# EAGLE design mb3 (EAGLE 7.3.2)
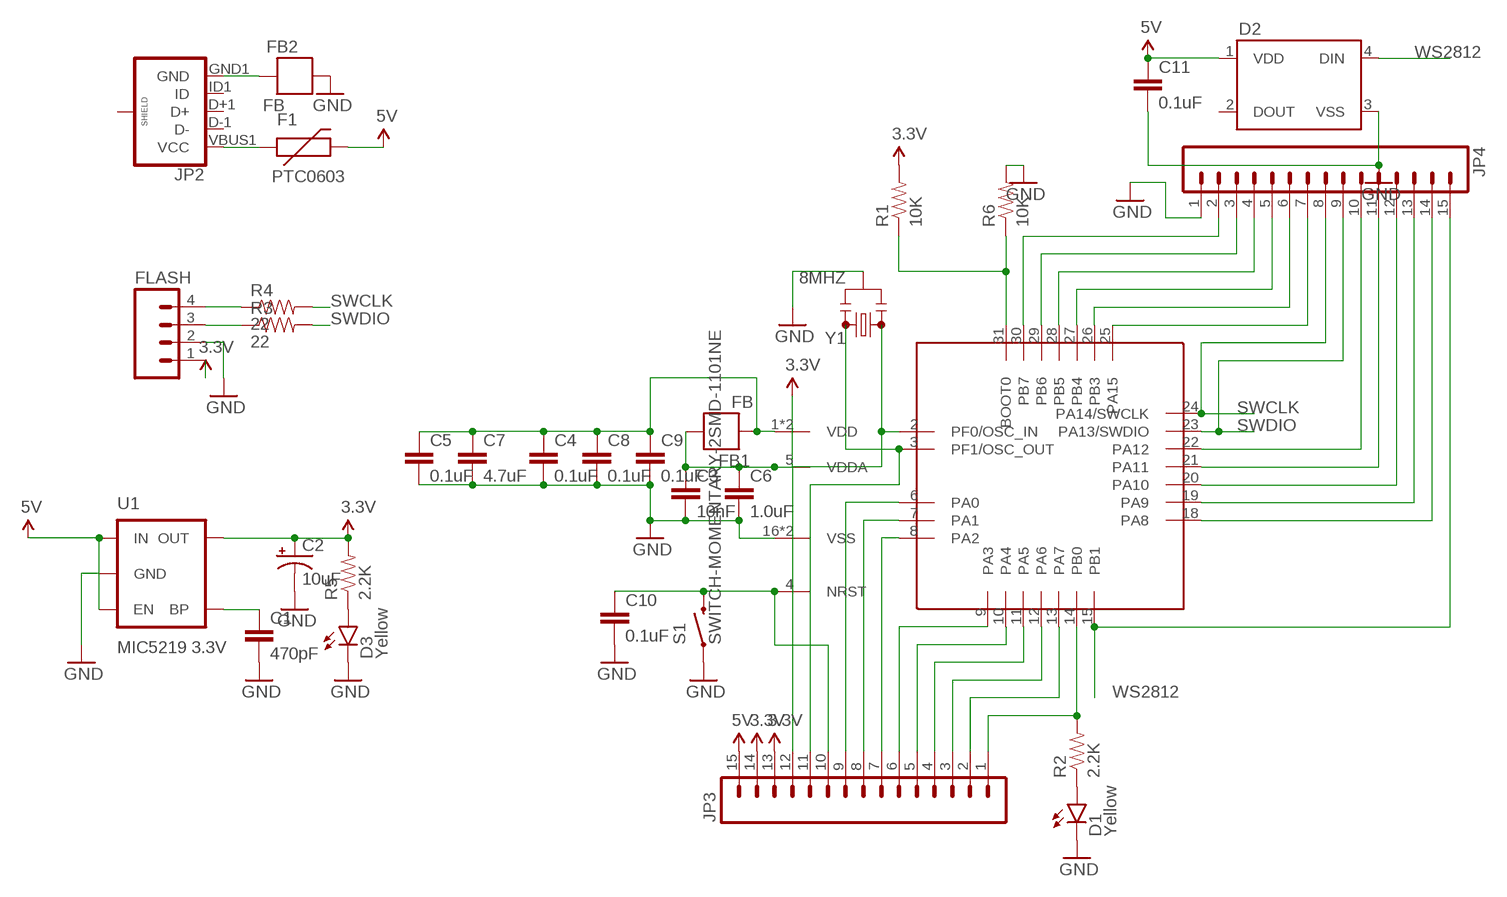
[diagram p0: schematic, sheet 1]

## Parts
C1  470pF  CAP0402-CAP  [0402-CAP]
C2  10uF  10UF-16V-10%(TANT)  [EIA3216]
C3  10nF  CAP0402-CAP  [0402-CAP]
C4  0.1uF  CAP0402-CAP  [0402-CAP]
C5  0.1uF  CAP0402-CAP  [0402-CAP]
C6  1.0uF  1.0UF-16V-10%(0603)  [0603-CAP]
C7  4.7uF  4.7UF-6.3V-10%(0603)0603  [0603-CAP]
C8  0.1uF  CAP0402-CAP  [0402-CAP]
C9  0.1uF  CAP0402-CAP  [0402-CAP]
C10  0.1uF  CAP0402-CAP  [0402-CAP]
C11  0.1uF  CAP0402-CAP  [0402-CAP]
D1  Yellow  LED-YELLOW0603  [LED-0603]
D2  WS2812B  [WS2812B]
D3  Yellow  LED-YELLOW0603  [LED-0603]
F1  PTC0603  [0603]
FB1  FB  [0603]
FB2  FB  [0603]
FLASH  M04SMD  [1X04-SMD]
JP2  USB_MICROB_PLUGCONN-11752  [USB-B-MICRO-SMD_V03]
JP3  M15LOCK  [1X15_LOCK]
JP4  M15LOCK  [1X15_LOCK]
R1  10K  22OHM1/10W1%(0402)  [0402-RES]
R2  2.2K  RESISTOR0402  [0402-RES]
R3  22  22OHM1/10W1%(0402)  [0402-RES]
R4  22  22OHM1/10W1%(0402)  [0402-RES]
R5  2.2K  RESISTOR0402  [0402-RES]
R6  10K  22OHM1/10W1%(0402)  [0402-RES]
S1  SWITCH-MOMENTARY-2SMD-1101NE  [TACTILE-SWITCH-1101NE]
U1  MIC5219 3.3V  V_REG_MIC52193.3V  [SOT23-5]
U2  STM32F030K6P6  [LQFP32-0.8]
Y1  8MHZ  RESONATOR8MHZ  [RESONATOR-SMD]

## Nets
3.3V: C2.A(+) C3.1 C6.1 FB1.1 FLASH.1 JP3.13 JP3.14 R1.2 R5.2 U1.5(OUT) U2.5(VDDA)
5V: C11.1 D2.1(VDD) F1.2 JP3.15 U1.1(IN) U1.3(EN)
A15: JP4.7 U2.25(PA15)
COPOY: C1.2 C2.C(-) C3.2 C4.2 C5.2 C6.2 C7.2 C8.2 C9.2 C10.2 C11.2 D1.C D2.3(VSS) D3.C FB2.1 FLASH.2 JP4.1 R6.2 S1.1 U1.2(GND) U2.16(VSS) U2.32(VSS) Y1.2 ; supply symbol labelled GND
N$1: C4.1 C5.1 C7.1 C8.1 C9.1 FB1.2 U2.1(VDD) U2.17(VDD)
N$3: C1.1 U1.4(BP)
N$4: FLASH.3 R3.1
N$5: FLASH.4 R4.1
N$7: D1.A R2.1
N$9: R1.1 R6.1 U2.31(BOOT0)
N$11: FB2.2 JP2.GND1(GND)
N$12: F1.1 JP2.VBUS1(VCC)
N$13: JP4.2 U2.30(PB7)
N$14: JP4.3 U2.29(PB6)
N$15: JP4.4 U2.28(PB5)
N$16: JP4.5 U2.27(PB4)
N$17: JP4.6 U2.26(PB3)
N$19: JP4.10 U2.22(PA12)
N$20: JP4.11 U2.21(PA11)
N$21: JP4.12 U2.20(PA10)
N$22: JP4.13 U2.19(PA9)
N$23: JP4.14 U2.18(PA8)
N$24: JP3.2 U2.13(PA7)
N$25: JP3.3 U2.12(PA6)
N$26: JP3.4 U2.11(PA5)
N$27: JP3.5 U2.10(PA4)
N$28: JP3.6 U2.9(PA3)
N$29: JP3.7 U2.8(PA2)
N$30: JP3.8 U2.7(PA1)
N$31: JP3.9 U2.6(PA0)
N$32: D3.A R5.1
NRST: C10.1 JP3.10 S1.2 U2.4(NRST)
PB0: JP3.1 R2.2 U2.14(PB0)
PF0: JP3.12 U2.2(PF0/OSC_IN) Y1.1
PF1: JP3.11 U2.3(PF1/OSC_OUT) Y1.3
SWCLK: JP4.8 R4.2 U2.24(PA14/SWCLK)
SWDIO: JP4.9 R3.2 U2.23(PA13/SWDIO)
WS2812: D2.4(DIN) JP4.15 U2.15(PB1)
Unconnected: D2.2(DOUT) JP2.D+1(D+) JP2.D-1(D-) JP2.ID1(ID) JP2.SHIELD1(SHIELD) JP2.SHIELD2(SHIELD) JP2.SHIELD3(SHIELD)

## Library data of the parts
C1 C3-C5 C8-C11 = SparkFun-Capacitors:CAP: Capacitor Standard 0603 ceramic capacitor, and 0.1" leaded capacitor.
C2 = SparkFun-Capacitors:10UF-16V-10%(TANT): CAP-00811 1206/EIA-3216 Tantalum capacitor; PROD_ID: CAP-00811
C6 = SparkFun-Capacitors:1.0UF-16V-10%(0603): CAP-00868; PROD_ID: CAP-00868
C7 = SparkFun-Capacitors:4.7UF-6.3V-10%(0603): CAP-08280; PROD_ID: CAP-08280
D1 D3 = SparkFun-LED:LED-YELLOW: Yellow SMD LEDs LilyPad 1206- DIO-09909 0603- DIO-09003 "SMART" means more efficient and expensive; PROD_ID: DIO-09003
D2 = SparkFun-LED:WS2812B: WS2812B - Intelligent control LED integrated light source Technical Specifications: Power Supply Voltage (VDD): 3.5 to 5.3 V Input Voltage (VI): -0.5 to VDD+0.5 V Operating Junction Temperature (Topt): -25°C to +80°C Storage Temperature Range (Tstg): -55°C to +150°C; PROD_ID: DIO-12503
F1 = SparkFun-PowerIC:PTC: Resettable Fuse PTC Resettable Fuse. Spark Fun Electronics SKU : COM-08357
FB1 FB2 = SparkFun-Passives:FB
FLASH = SparkFun-Connectors:M04: Header 4 Standard 4-pin 0.1" header. Use with straight break away headers (SKU : PRT-00116), right angle break away headers (PRT-00553), swiss pins (PRT-00743), machine pins (PRT-00117), and female headers (PRT-00115). Molex polarized connector foot print use with SKU : PRT-08231 with associated crimp pins and housings. 1MM SMD Version SKU: PRT-10208
JP2 = SparkFun-Connectors:USB_MICROB_PLUG: USB Micro-B connectors Some male, some female. Watch your step!; PROD_ID: CONN-11752
JP3 JP4 = SparkFun-Connectors:M15: Header 15 Standard 15-pin 0.1" header. Use with straight break away headers (SKU : PRT-00116), right angle break away headers (PRT-00553), swiss pins (PRT-00743), machine pins (PRT-00117), and female headers (PRT-00115).
R1 R6 = SparkFun-Resistors:22OHM1/10W1%(0402); PROD_ID: RES-12427; VALUE: 22
R2 R5 = SparkFun-Resistors:RESISTOR: Resistor Basic schematic elements and footprints for 0603, 1206, and PTH resistors.
R3 R4 = SparkFun-Resistors:22OHM1/10W1%(0402); PROD_ID: RES-12427
S1 = SparkFun-Electromechanical:SWITCH-MOMENTARY-2: Various NO switches- pushbuttons, reed, etc; PROD_ID: SWCH-00815
U1 = SparkFun-PowerIC:V_REG_MIC5219: V_REG MIC5219 Standard 3.3V and 5V 500mA LDO voltage regulator in SOT-23 layout. Micrel part MIC5219. BP (by-pass) pin is used to lower output noise with 470pF cap, may be left open.; PROD_ID: VREG-09872
U2 = r1:STM32F030K6P6
Y1 = SparkFun-FreqCtrl:RESONATOR: Resonator Small SMD resonator. Used, eg, on the Arduino Pro/ Pro Mini boards. 8MHz- XTAL-08895 16MHz- XTAL-08900; PROD_ID: XTAL-08895

## Board
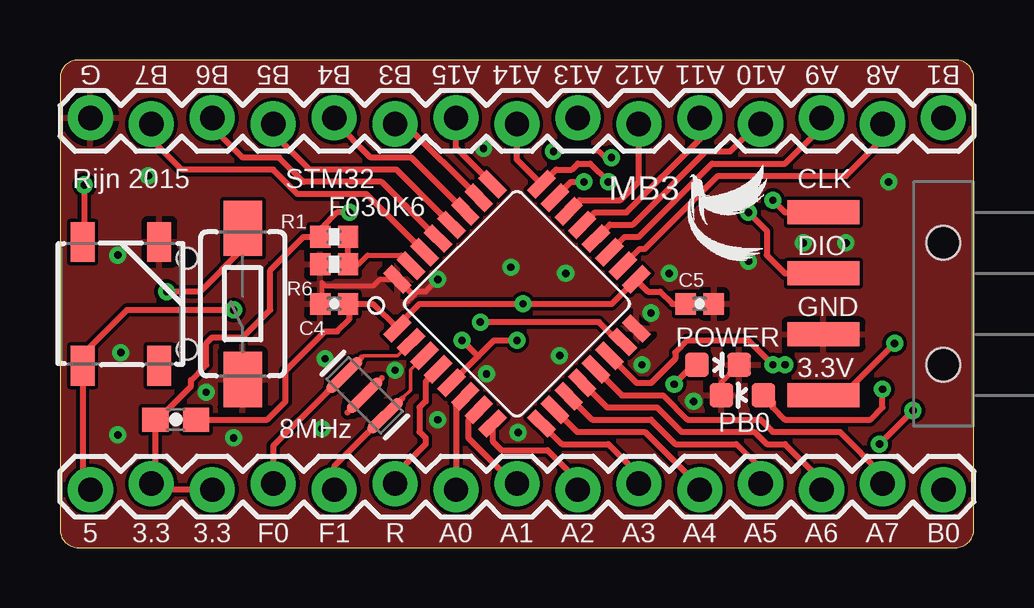
[diagram p1: board, top side]
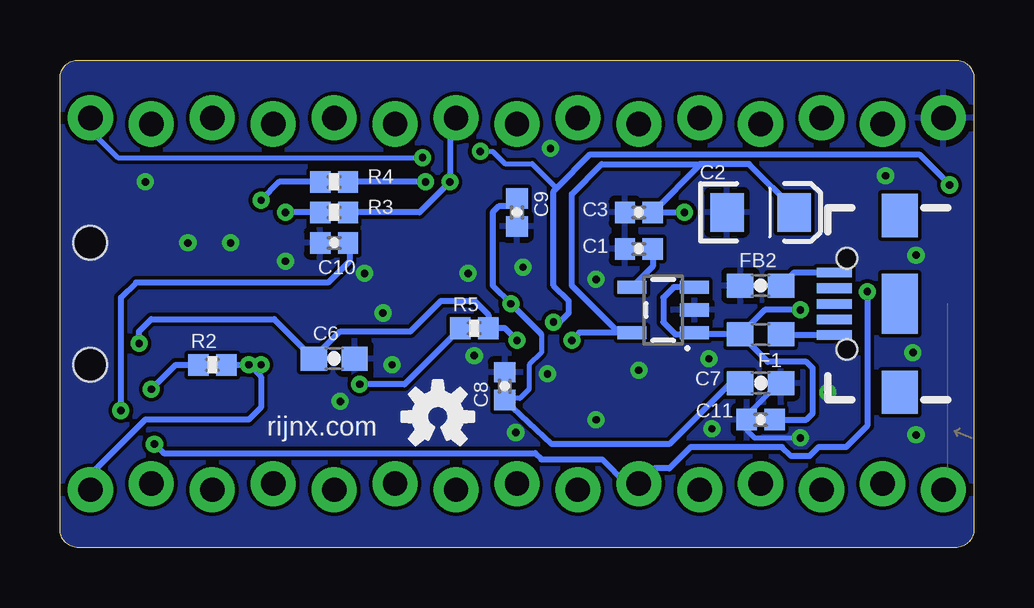
[diagram p2: board, bottom side, seen from below]

Size 38.1 x 20.32 mm. Coordinates in mm from the lower left corner, seen from the top.
Outline: 0,19.56 0,0.76 arc90 0.76,0 37.34,0 arc90 38.1,0.76 38.1,19.56 arc90 37.34,20.32 0.76,20.32 arc90 0,19.56
Copper layers (1*16): Top 0.035mm / dielectric 1.5mm / Bottom 0.035mm
Design rules "default *": minimum track width 6mil, minimum drill 12mil, track to track 6mil, track to pad 6mil, pad to pad 6mil, via to via 6mil, smd to smd 6mil, copper to edge 1mil, drill to drill 6mil, minimum pad ring 10mil, minimum via ring 8mil, stop-mask expansion 0mil, vias tented up to drill 18mil, thermal gap 10mil

### Footprints (pad centres in the part's own frame; a part is rotated, then mirrored left to right if it is on the bottom)
0402-CAP = smd 0.85 x 0.9: 1 -0.58,0; 2 0.58,0
EIA3216 = smd 1.4 x 1.6: A 1.4,0; C -1.4,0
0603-CAP = smd 1.1 x 1: 1 -0.85,0; 2 0.85,0
LED-0603 = smd 1 x 1: A 0,-0.877; C 0,0.877
WS2812B = smd 1.651 x 1: 1 -2.577,1.6; 2 -2.577,-1.6; 3 2.577,-1.6; 4 2.577,1.6
0603 = smd 1.1 x 1: 1 -0.85,0; 2 0.85,0
1X04-SMD = smd 1 x 3: 1 -3.81,5; 2 -1.27,5; 3 1.27,5; 4 3.81,5 | hole 1.4: -2.54,0; 2.54,0
USB-B-MICRO-SMD_V03 = smd 1.45 x 0.4: D+1 2.725,0; D-1 2.725,0.65; GND1 2.725,-1.3; ID1 2.725,-0.65; VBUS1 2.725,1.3 | smd 1.5 x 1.8: SHIELD1 0,3.685; SHIELD2 0,-3.685 | smd 1.5 x 2.5: SHIELD3 0,0 | hole 0.85: 2.2,1.9; 2.2,-1.9
1X15_LOCK = drill 1.016 pad 1.88: 1 0,0.127; 2 2.54,-0.127; 3 5.08,0.127; 4 7.62,-0.127; 5 10.16,0.127; 6 12.7,-0.127; 7 15.24,0.127; 8 17.78,-0.127; 9 20.32,0.127; 10 22.86,-0.127; 11 25.4,0.127; 12 27.94,-0.127; 13 30.48,0.127; 14 33.02,-0.127; 15 35.56,0.127
0402-RES = smd 0.85 x 0.9: 1 -0.58,0; 2 0.58,0
TACTILE-SWITCH-1101NE = smd 2.3 x 1.6: 1 -3.15,0; 2 3.15,0
SOT23-5 = smd 0.55 x 1.2: 1 -0.95,-1.3; 2 0,-1.3; 3 0.95,-1.3; 4 0.95,1.3; 5 -0.95,1.3
LQFP32-0.8 = smd 0.5 x 1.2: 1 -2.8,-4.25; 2 -2,-4.25; 3 -1.2,-4.25; 4 -0.4,-4.25; 5 0.4,-4.25; 6 1.2,-4.25; 7 2,-4.25; 8 2.8,-4.25; 17 2.8,4.25; 18 2,4.25; 19 1.2,4.25; 20 0.4,4.25; 21 -0.4,4.25; 22 -1.2,4.25; 23 -2,4.25; 24 -2.8,4.25 | smd 1.2 x 0.5: 9 4.25,-2.8; 10 4.25,-2; 11 4.25,-1.2; 12 4.25,-0.4; 13 4.25,0.4; 14 4.25,1.2; 15 4.25,2; 16 4.25,2.8; 25 -4.25,2.8; 26 -4.25,2; 27 -4.25,1.2; 28 -4.25,0.4; 29 -4.25,-0.4; 30 -4.25,-1.2; 31 -4.25,-2; 32 -4.25,-2.8
RESONATOR-SMD = smd 0.45 x 1.905: 1 -1.2,0; 2 0,0; 3 1.2,0

### Placement (x,y rotation side)
C1  13.97,12.45 180 bottom
C2  8.89,13.97 0 bottom
C3  13.97,13.97 180 bottom
C4  11.43,10.16 180 top
C5  26.67,10.16 0 top
C6  26.67,7.87 0 bottom
C7  8.89,6.86 0 bottom
C8  19.56,6.73 90 bottom
C9  19.05,13.97 270 bottom
C10  26.67,12.7 180 bottom
C11  8.89,5.33 180 bottom
D1  28.45,6.35 90 top
D2  2.54,10.16 90 top
D3  27.43,7.62 270 top
F1  8.89,8.89 180 bottom
FB1  4.83,5.33 0 top
FB2  8.89,10.92 0 bottom
FLASH  36.83,10.16 90 top
JP2  3.1,10.16 180 bottom
JP3  36.83,2.54 180 top
JP4  1.27,17.78 0 top
R1  11.43,12.95 180 top
R2  31.75,7.62 0 bottom
R3  26.67,13.97 0 bottom
R4  26.67,15.24 0 bottom
R5  20.83,9.14 0 bottom
R6  11.43,11.81 180 top
S1  7.62,10.16 90 top
U1  12.95,9.91 90 bottom
U2  19.05,10.16 315 top
U$1  [LOGO]  26.16,11.94 0 top
U$2  [OSHW-LOGO-S]  22.35,5.46 0 bottom
Y1  12.7,6.35 315 top

### Tracks (layer width: path | path; a pad name or v marks a point on that pad's centre or on a via)
3.3V  (via drill 0.3)
  Top 0.254: U2.5 17.43,7.97 | 17.43,7.97 18.09,8.64 v19.05,8.64 | v16.76,8.64 | v16.76,8.64 17.43,7.97 | v12.06,13.97 11.56,13.97 10.92,13.33 10.92,12.77 R1.2 10.16,12.95 8.76,11.56 8.76,9.91 7.62,8.76 6.35,8.76 6.1,8.51 6.1,7.62 5.46,6.98 5.46,6.73 4.06,5.33 FB1.1 3.98,2.83 JP3.14 4.06,2.41 JP3.13 | FLASH.1 32.64,6.35 v34.8,8.51
  Bottom 0.254: v19.05,8.64 19.56,9.14 R5.2 20.24,9.7 20.83,10.29 22.23,10.29 23.5,9.02 26.42,9.02 27.52,7.91 C6.1 29.17,9.53 34.29,9.53 34.8,9.02 v34.8,8.51 | C2.A 7.49,14.09 9.37,15.98 11.38,15.98 11.39,15.97 | 11.39,15.97 C3.1 v12.06,13.97 | U1.5 14.8,8.96 | 14.8,8.96 16.76,10.92 16.76,14.73 15.52,15.98 11.43,15.98 11.39,15.97 | 14.8,8.96 16.44,8.96 v16.76,8.64
5V  (via drill 0.3)
  Top 0.254: JP3.15 0.94,2.74 D2.1 0.94,8.05 2.79,9.91 v7.24,9.91
  Bottom 0.254: F1.2 11.59,8.89 U1.1 11.72,8.89 12.45,8.89 12.95,9.4 12.95,10.41 12.51,10.86 U1.3 | v7.24,9.91 8.72,9.91 F1.2 | C11.1 6.99,5.33 6.73,5.59 6.73,7.49 6.99,7.75 8.6,7.75 F1.2
A15
  Top 0.254: U2.25 16.51,16.66 JP4.7
COPOY  (via drill 0.3)
  Top 0.203: C4.2 10.92,10.23 10.92,11.05 11.05,10.92 13.08,10.92 13.34,11.18 U2.32 | D1.C 27.57,6.88 D3.C
  Top 0.254: 14.67,10.48 14.86,10.67 15.24,10.67 v15.75,11.18 | 14.67,10.48 14.48,10.29 | U2.32 14.67,10.58 14.67,10.48
  Bottom 0.203: v7.24,4.57 9.14,4.57 9.47,4.9 C11.2 9.47,5.52 8.13,6.86 C7.2 7.89,7.01
  other vias: 18.8,11.68 34.54,15.24 30.99,12.7 32.77,12.7 28.7,11.94 25.4,11.43 21.08,11.43 20.83,8 15.75,5.33 10.92,4.95 2.41,4.7 3.68,15.49 2.41,12.19 2.54,8.13 19.1,4.8 13.97,7.39 17.78,7.24 26.42,6.1 24.64,9.78 24.26,7.62 17.65,16.64 11.05,7.87 6.1,6.48
  pour Top: -2.54,24.13 -2.54,-1.27 39.37,-1.27 39.37,24.13
  pour Bottom: -1.27,20.32 45.72,20.32 45.72,0 -1.27,0
N$1  (via drill 0.3)
  Top 0.254: C5.1 25.53,10.16 25.02,10.67 24.51,10.67 24.04,11.14 U2.17 23.01,10.16 v19.3,10.16 14.99,10.16 14.06,9.24 U2.1 13.04,10.16 C4.1 12.06,10.11 12.06,9.53 11.56,9.02 11.05,9.02 9.4,7.37 9.4,6.1 8.64,5.33 FB1.2
  Bottom 0.203: 18.03,8.89 18.03,8.13 18.54,7.62 18.54,6.6 18.92,6.22 19.49,6.22 C8.1
  Bottom 0.254: C9.1 19.05,14.22 19.81,14.22 20.07,13.97 20.07,10.92 v19.3,10.16 18.03,8.89 | C7.1 10.16,6.86 12.7,4.32 17.6,4.32 C8.1
N$3
  Bottom 0.254: C1.1 13.39,11.72 U1.4
N$4  (via drill 0.3)
  Top 0.254: v28.7,13.97 29.46,13.21 29.46,12.19 30.23,11.43 FLASH.3
  Bottom 0.254: R3.1 v28.7,13.97
N$5  (via drill 0.3)
  Top 0.254: FLASH.4 30.23,13.97 v29.72,14.48
  Bottom 0.254: R4.1 28.96,15.24 v29.72,14.48
N$7  (via drill 0.3)
  Top 0.254: D1.A 29.46,6.35 29.72,6.1 29.72,5.84 30.23,5.33 33.78,5.33 34.29,5.84 v34.29,6.6
  Bottom 0.254: v34.29,6.6 33.27,7.62 R2.1
N$9
  Top 0.203: 12.45,11.81 12.83,12.19 14.22,12.19 14.63,11.79 U2.31
  Top 0.254: R1.1 R6.1 12.45,11.81
N$11
  Bottom 0.254: JP2.GND1 7.5,11.46 FB2.2
N$12
  Bottom 0.254: JP2.VBUS1 8.01,8.86 F1.1
N$13
  Top 0.254: U2.30 12.78,14.73 9.91,14.73 8.89,15.75 5.08,15.75 3.81,17.02 JP4.2
N$14
  Top 0.254: U2.29 13.4,15.24 10.16,15.24 9.14,16.26 7.62,16.26 6.35,17.53 JP4.3
N$15
  Top 0.254: U2.28 14.03,15.75 10.41,15.75 8.89,17.27 JP4.4
N$16
  Top 0.254: U2.27 14.65,16.26 12.95,16.26 11.43,17.78 JP4.5
N$17
  Top 0.254: U2.26 14.38,17.65 JP4.6
N$19
  Top 0.254: U2.22 21.67,14.48 23.37,14.48 24.13,15.24 JP4.10
N$20
  Top 0.254: U2.21 22.29,13.97 23.62,13.97 26.67,17.02 JP4.11
N$21
  Top 0.254: U2.20 22.92,13.46 23.88,13.46 26.92,16.51 27.94,16.51 29.08,17.65 JP4.12
N$22
  Top 0.254: U2.19 23.54,12.95 24.13,12.95 27.18,16 30.23,16 31.75,17.53 JP4.13
N$23
  Top 0.254: U2.18 24.16,12.45 24.38,12.45 27.43,15.49 32.77,15.49 34.29,17.02 JP4.14
N$24
  Top 0.254: U2.13 23.43,6.35 25.15,6.35 26.16,5.33 29.21,5.33 29.72,4.83 32.51,4.83 34.29,3.05 JP3.2
N$25
  Top 0.254: U2.12 22.8,5.84 24.89,5.84 25.91,4.83 28.96,4.83 29.46,4.32 30.23,4.32 31.75,2.79 JP3.3
N$26
  Top 0.254: U2.11 22.18,5.33 24.64,5.33 25.65,4.32 28.19,4.32 29.21,3.3 JP3.4
N$27
  Top 0.254: U2.10 21.56,4.83 24.38,4.83 26.67,2.54 JP3.5
N$28
  Top 0.254: U2.9 20.93,4.32 22.86,4.32 24.13,3.05 JP3.6
N$29
  Top 0.254: JP3.7 21.59,2.79 20.32,4.06 18.41,4.06 18.03,4.45 18.03,5.17 U2.8
N$30
  Top 0.254: U2.7 17.02,5.3 17.02,4.57 18.92,2.67 JP3.8
N$31
  Top 0.254: U2.6 16.51,5.92 JP3.9
N$32  (via drill 0.3)
  Top 0.254: v25.6,6.81 26.42,7.62 D3.A
  Bottom 0.254: R5.1 23.75,6.81 v25.6,6.81
NRST  (via drill 0.3)
  Top 0.254: U2.4 15.24,6.92 15.24,6.1 14.99,5.84 14.99,4.83 15.24,4.57 15.24,4.32 13.97,3.05 JP3.10 | S1.2 7.62,12.45 5.84,10.67 v4.45,10.67 | v35.56,5.71 v34.16,4.32
  Bottom 0.254: v4.45,10.67 4.45,5.08 5.33,4.19 6.48,4.19 6.86,3.81 7.62,3.81 8,4.19 11.81,4.19 12.7,3.3 13.34,3.3 JP3.10 14.48,2.67 15.49,3.68 18.03,3.68 18.29,3.94 33.78,3.94 v34.16,4.32 | C10.1 26.04,12.64 26.04,11.94 26.92,11.05 34.92,11.05 35.56,10.41 v35.56,5.71
PB0  (via drill 0.3)
  Top 0.254: v30.23,7.62 v29.72,7.62 28.7,8.64 26.16,8.64 25.65,8.13 25.65,7.87 24.64,6.86 24.05,6.86 U2.14
  Bottom 0.254: R2.2 v30.23,7.62 | v29.72,7.62 v30.23,7.62 | v30.23,7.62 29.72,7.11 29.72,5.84 30.23,5.33 34.54,5.33 36.83,3.05 JP3.1
PF0
  Top 0.152: U2.2 14.06,8 12.65,8 12.57,7.92
  Top 0.254: 11.13,6.48 8.89,4.24 JP3.12
PF1
  Top 0.152: U2.3 14.61,7.41 14.61,6.56 14.27,6.22
  Top 0.254: 12.83,4.78 11.43,3.38 JP3.11
SWCLK  (via drill 0.3)
  Top 0.254: JP4.8 19.05,16.17 U2.24 20.68,15.75 21.34,15.75 21.59,16 22.1,16 v22.86,15.24
  Bottom 0.254: v22.86,15.24 R4.2
SWDIO  (via drill 0.3)
  Top 0.254: U2.23 21.3,15.24 v21.84,15.24
  Bottom 0.254: R3.2 23.11,13.97 v21.84,15.24 21.84,17.65 JP4.9
WS2812  (via drill 0.3)
  Top 0.203: v22.99,16.26 22.73,16.26 22.48,16.51 v20.57,16.51
  Top 0.254: U2.15 23.31,8.57 22.48,9.4 v17.53,9.4 | v1.02,15.11 1.02,12.81 D2.4
  Bottom 0.203: JP4.15 36.83,17.4 35.69,16.26 v22.99,16.26 | v20.57,16.51 20.07,16.51 19.56,16 18.41,16 17.4,14.99
  Bottom 0.254: v17.53,9.4 17.27,9.4 16.89,9.78 16.89,10.29 17.53,10.92 17.53,14.86 17.4,14.99 16,16.38 2.29,16.38 v1.02,15.11

### Text on the board
tNames: G | B7 | B6 | B5 | B4 | B3 | A15 | A14 | A13 | A12 | A11 | A10 | A9 | A8 | B1 | Rijn 2015 | STM32 | CLK | F030K6 | MB3 | DIO | GND | POWER | 3.3V | PB0 | 8MHz | 5 | 3.3 | 3.3 | F0 | F1 | R | A0 | A1 | A2 | A3 | A4 | A5 | A6 | A7 | B0
bNames: rijnx.com